# Altium schematic sheet Sheet1.SchDoc
size A4
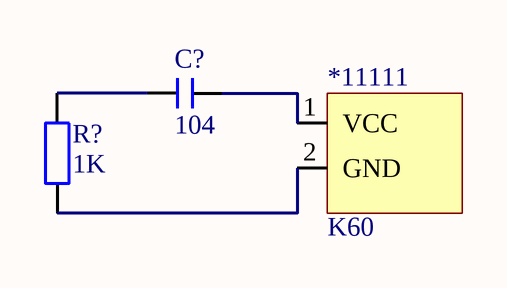
[diagram p0: Sheet1.SchDoc]

## Parts
*11111  K60  [K60]
C?  104  [C 0805_M]
R?  1K  [R 0805_L]

## Nets
Net*11111_1: *11111.1(VCC) C?.2
Net*11111_2: *11111.2(GND) R?.1
NetC?_1: C?.1 R?.2

## Library data of the parts
C? = C: 无极性贴片电容; 版权归属: 源创客; BOM名称: 无极性贴片电容; 学习资源: www.ooocke.com
R? = R: 贴片电阻; 版权归属: 源创客; BOM名称: 贴片电阻; 学习资源: www.ooocke.com